# EAGLE design bt (EAGLE 7.4.0)
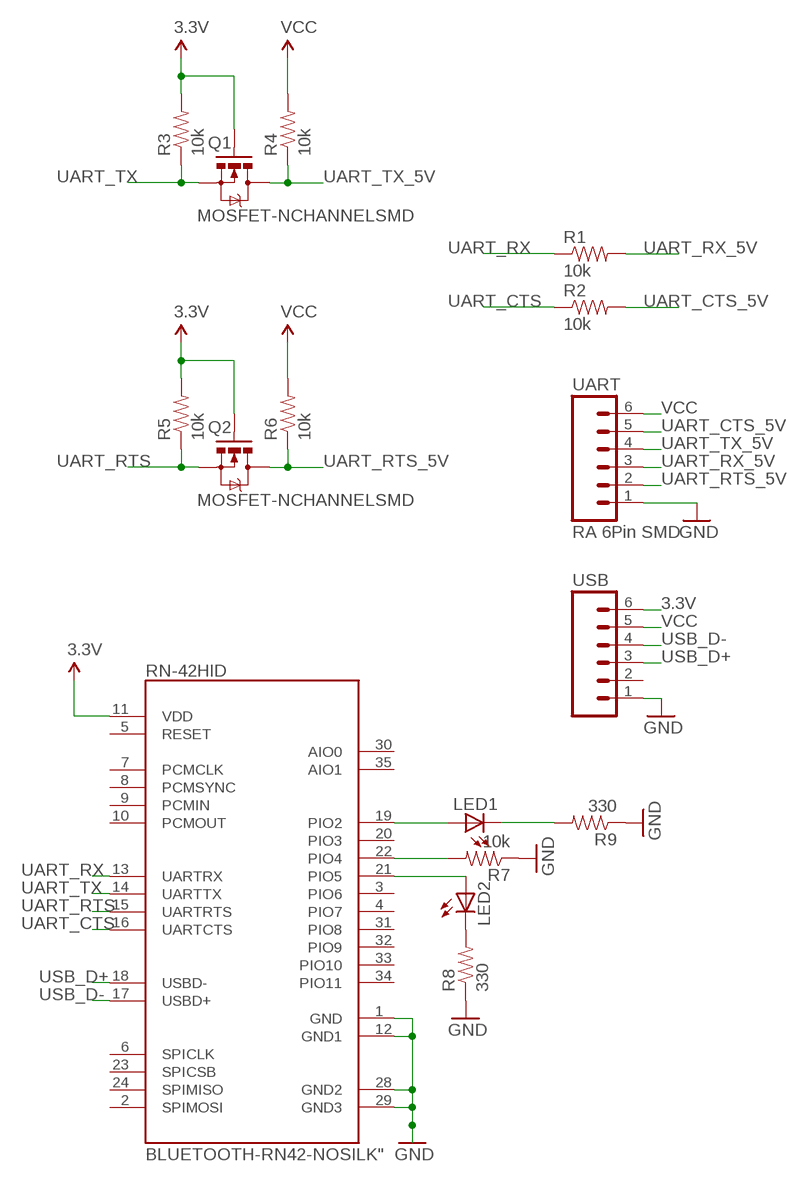
[diagram p0: schematic, sheet 1]

## Parts
LED1  LEDCHIP-LED0805  [CHIP-LED0805]
LED2  LEDCHIP-LED0805  [CHIP-LED0805]
Q1  MOSFET-NCHANNELSMD  [SOT23-3]
Q2  MOSFET-NCHANNELSMD  [SOT23-3]
R1  10k  0.22OHM-1/4W-1%(0805)  [0805]
R2  10k  0.22OHM-1/4W-1%(0805)  [0805]
R3  10k  0.22OHM-1/4W-1%(0805)  [0805]
R4  10k  0.22OHM-1/4W-1%(0805)  [0805]
R5  10k  0.22OHM-1/4W-1%(0805)  [0805]
R6  10k  0.22OHM-1/4W-1%(0805)  [0805]
R7  10k  0.22OHM-1/4W-1%(0805)  [0805]
R8  330  0.22OHM-1/4W-1%(0805)  [0805]
R9  330  0.22OHM-1/4W-1%(0805)  [0805]
RN-42HID  BLUETOOTH-RN42-NOSILK"  [RN41]
UART  RA 6Pin SMD  M06SMD-NOHOLES  [1X06-SMD-NOHOLES]
USB  M06SMD-FEMALE-V2-NOSILK  [1X06-SMD-FEMALE-V2-NOSILK]

## Nets
3.3V: Q1.1(G) Q2.1(G) R3.2 R5.2 USB.6
GND: R7.1 R8.1 R9.1 RN-42HID.1(GND) RN-42HID.12(GND1) RN-42HID.28(GND2) RN-42HID.29(GND3) UART.1 USB.1
N$1: LED2.C R8.2
N$3: LED1.C R9.2
N$8: LED1.A RN-42HID.19(PIO2)
N$9: R7.2 RN-42HID.22(PIO4)
N$10: LED2.A RN-42HID.21(PIO5)
UART_CTS: R2.1 RN-42HID.16(UARTCTS)
UART_CTS_5V: R2.2 UART.5
UART_RTS: Q2.2(S) R5.1 RN-42HID.15(UARTRTS)
UART_RTS_5V: Q2.3(D) R6.1 UART.2
UART_RX: R1.1 RN-42HID.13(UARTRX)
UART_RX_5V: R1.2 UART.3
UART_TX: Q1.2(S) R3.1 RN-42HID.14(UARTTX)
UART_TX_5V: Q1.3(D) R4.1 UART.4
USB_D+: RN-42HID.18(USBD-) USB.3
USB_D-: RN-42HID.17(USBD+) USB.4
VCC: R4.2 R6.2 RN-42HID.11(VDD) UART.6 USB.5 ; supply symbol labelled 3.3V
Unconnected: RN-42HID.2(SPIMOSI) RN-42HID.3(PIO6) RN-42HID.4(PIO7) RN-42HID.5(RESET) RN-42HID.6(SPICLK) RN-42HID.7(PCMCLK) RN-42HID.8(PCMSYNC) RN-42HID.9(PCMIN) RN-42HID.10(PCMOUT) RN-42HID.20(PIO3) RN-42HID.23(SPICSB) RN-42HID.24(SPIMISO) RN-42HID.30(AIO0) RN-42HID.31(PIO8) RN-42HID.32(PIO9) RN-42HID.33(PIO10) RN-42HID.34(PIO11) RN-42HID.35(AIO1) USB.2

## Library data of the parts
LED1 LED2 = adafruit:LED: LED OSRAM: - CHIPLED LG R971, LG N971, LY N971, LG Q971, LY Q971, LO R971, LY R971 LH N974, LH R974 LS Q976, LO Q976, LY Q976 LO Q996 - Hyper CHIPLED LW Q18S LB Q993, LB Q99A, LB R99A - SideLED LS A670, LO A670, LY A670, LG A670, LP A670 LB A673, LV A673, LT A673, LW A673 LH A674 LY A675 LS A676, LA A676, LO A676, LY A676, LW A676 LS A679, LY A679, LG A679 - Hyper Micro SIDELED® LS Y876, LA Y876, LO Y876, LY Y876 LT Y87S - SmartLED LW L88C, LW L88S LB L89C, LB L89S, LG L890 LS L89K, LO L89K, LY L89K LS L896, LA L896, LO L896, LY L896 - TOPLED LS T670, LO T670, LY T670, LG T670, LP T670 LSG T670, LSP T670, LSY T670, LOP T670, LYG T670 LG T671, LOG T671, LSG T671 LB T673, LV T673, LT T673, LW T673 LH T674 LS T676, LA T676, LO T676, LY T676, LB T676, LH T676, LSB T676, LW T676 LB T67C, LV T67C, LT T67C, LS T67K, LO T67K, LY T67K, LW E67C LS E67B, LA E67B, LO E67B, LY E67B, LB E67C, LV E67C, LT E67C LW T67C LS T679, LY T679, LG T679 LS T770, LO T770, LY T770, LG T770, LP T770 LB T773, LV T773, LT T773, LW T773 LH T774 LS E675, LA E675, LY E675, LS T675 LS T776, LA T776, LO T776, LY T776, LB T776 LHGB T686 LT T68C, LB T68C - Hyper Mini TOPLED® LB M676 - Mini TOPLED Santana® LG M470 LS M47K, LO M47K, LY M47K Source: http://www.osram.convergy.de/
Q1 Q2 = SparkFun:MOSFET-NCHANNEL
R1-R9 = SparkFun-Resistors:0.22OHM-1/4W-1%(0805): RES-09883; PROD_ID: RES-09883; VALUE: 0.22
RN-42HID = mine:BLUETOOTH-RN42-NOSILK: Bluetooth SMD module
UART = mine:M06: Header 6 Standard 6-pin 0.1" header. Use with straight break away headers (SKU : PRT-00116), right angle break away headers (PRT-00553), swiss pins (PRT-00743), machine pins (PRT-00117), and female headers (PRT-00115). Molex polarized connector foot print use with SKU : PRT-08094 with associated crimp pins and housings. NOTES ON THE VARIANTS LOCK and LOCK_LONGPADS... This footprint was designed to help hold the alignment of a through-hole component (i.e. 6-pin header) while soldering it into place. You may notice that each hole has been shifted either up or down by 0.005 of an inch from it's more standard position (which is a perfectly straight line). This slight alteration caused the pins (the squares in the middle) to touch the edges of the holes. Because they are alternating, it causes a "brace" to hold the component in place. 0.005 has proven to be the perfect amount of "off-center" position when using our standard breakaway headers. Although looks a little odd when you look at the bare footprint, once you have a header in there, the alteration is very hard to notice. Also,if you push a header all the way into place, it is covered up entirely on the bottom side. This idea of altering the position of holes to aid alignment will be further integrated into the Sparkfun Library for other footprints. It can help hold any component with 3 or more connection pins.; PROD_ID: CONN-08971
USB = mine:M06: Header 6 Standard 6-pin 0.1" header. Use with straight break away headers (SKU : PRT-00116), right angle break away headers (PRT-00553), swiss pins (PRT-00743), machine pins (PRT-00117), and female headers (PRT-00115). Molex polarized connector foot print use with SKU : PRT-08094 with associated crimp pins and housings. NOTES ON THE VARIANTS LOCK and LOCK_LONGPADS... This footprint was designed to help hold the alignment of a through-hole component (i.e. 6-pin header) while soldering it into place. You may notice that each hole has been shifted either up or down by 0.005 of an inch from it's more standard position (which is a perfectly straight line). This slight alteration caused the pins (the squares in the middle) to touch the edges of the holes. Because they are alternating, it causes a "brace" to hold the component in place. 0.005 has proven to be the perfect amount of "off-center" position when using our standard breakaway headers. Although looks a little odd when you look at the bare footprint, once you have a header in there, the alteration is very hard to notice. Also,if you push a header all the way into place, it is covered up entirely on the bottom side. This idea of altering the position of holes to aid alignment will be further integrated into the Sparkfun Library for other footprints. It can help hold any component with 3 or more connection pins.; PROD_ID: CONN-09668

## Board
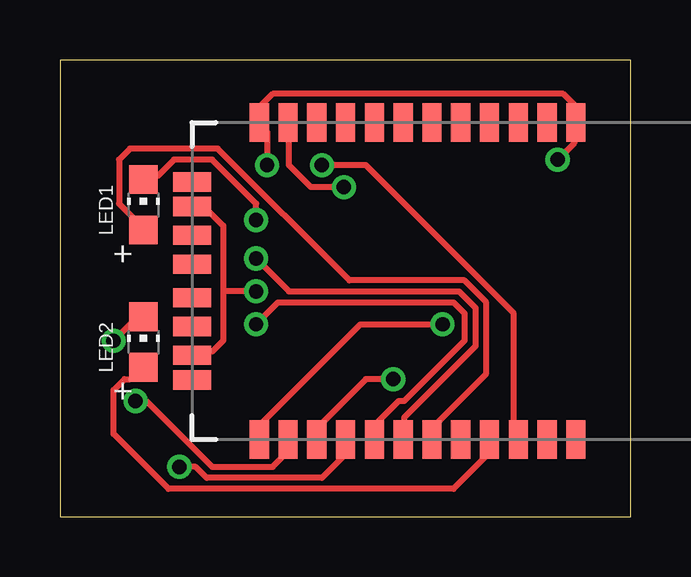
[diagram p1: board, top side]
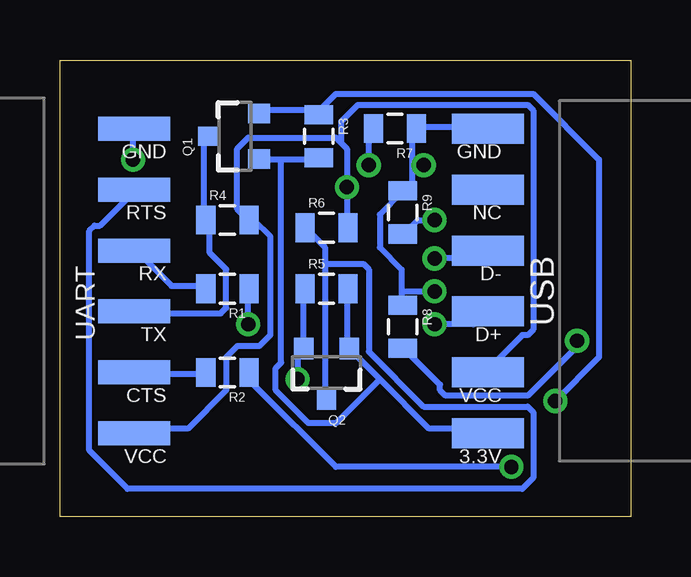
[diagram p2: board, bottom side, seen from below]

Size 23.8 x 19.04 mm. Coordinates in mm from the lower left corner, seen from the top.
Outline: 23.8,19.04 0,19.04 0,0 23.8,0 23.8,19.04
Copper layers (1*16): Top 0.035mm / dielectric 1.5mm / Bottom 0.035mm
Design rules "default": minimum track width 10mil, minimum drill 0.6mm, track to track 8mil, track to pad 8mil, pad to pad 8mil, via to via 8mil, smd to smd 8mil, copper to edge 40mil, drill to drill 8mil, minimum pad ring 10mil, minimum via ring 8mil, stop-mask expansion 4mil, vias tented up to drill 0mil, thermal gap 10mil

### Footprints (pad centres in the part's own frame; a part is rotated, then mirrored left to right if it is on the bottom)
CHIP-LED0805 = smd 1.2 x 1.2: A 0,-1.05; C 0,1.05
SOT23-3 = smd 0.8 x 0.9: 1 -0.95,-1; 2 0.95,-1; 3 0,1.1
0805 = smd 0.8 x 1.2: 1 -0.9,0; 2 0.9,0
RN41 = smd 0.8 x 1.6: 1 -6.6,-6.6; 2 -5.4,-6.6; 3 -4.2,-6.6; 4 -3,-6.6; 5 -1.8,-6.6; 6 -0.6,-6.6; 7 0.6,-6.6; 8 1.8,-6.6; 9 3,-6.6; 10 4.2,-6.6; 11 5.4,-6.6; 12 6.6,-6.6; 13 6.6,6.6; 14 5.4,6.6; 15 4.2,6.6; 16 3,6.6; 17 1.8,6.6; 18 0.6,6.6; 19 -0.6,6.6; 20 -1.8,6.6; 21 -3,6.6; 22 -4.2,6.6; 23 -5.4,6.6; 24 -6.6,6.6 | smd 1.6 x 0.8: 28 9.4,3.1; 29 9.4,-3.1; 30 9.4,4.122; 31 9.4,1.9; 32 9.4,0.7; 33 9.4,-0.7; 34 9.4,-1.9; 35 9.4,-4.122
1X06-SMD-NOHOLES = smd 1 x 3: 1 -6.35,5; 2 -3.81,5; 3 -1.27,5; 4 1.27,5; 5 3.81,5; 6 6.35,5
1X06-SMD-FEMALE-V2-NOSILK = smd 1.25 x 3: 1 6.35,3.425; 2 3.81,3.425; 3 1.27,3.425; 4 -1.27,3.425; 5 -3.81,3.425; 6 -6.35,3.425

### Placement (x,y rotation side)
LED1  3.48,13.01 0 top
LED2  3.48,7.29 0 top
Q1  16.5,15.87 90 bottom
Q2  12.69,6.02 180 bottom
R1  16.82,9.52 180 bottom
R2  16.82,6.02 180 bottom
R3  13.01,15.87 270 bottom
R4  16.82,12.37 0 bottom
R5  12.69,9.52 0 bottom
R6  12.69,12.05 0 bottom
R7  9.83,16.18 180 bottom
R8  9.51,7.93 270 bottom
R9  9.51,12.69 270 bottom
RN-42HID  14.91,9.83 180 top
UART  25.71,9.83 270 bottom
USB  2.53,9.83 90 bottom

### Tracks (layer width: path | path; a pad name or v marks a point on that pad's centre or on a via)
3.3V
  Bottom 0.254: 14.58,14.89 13.21,14.89 R3.2 | 14.58,14.89 15.49,14.89 Q1.1 | R5.2 11.84,9.4 11.84,7.12 Q2.1 11.61,6.89 10.46,5.74 | 10.46,5.74 8.41,3.69 6.12,3.69 USB.6 | 14.58,14.89 14.58,6.43 14.81,6.2 14.81,5.29 13.44,3.91 12.29,3.91 10.46,5.74
GND  (via drill 0.6)
  Top 0.254: 6.81,9.4 6.81,12.14 6.12,12.83 5.66,12.83 RN-42HID.29 | 6.81,9.4 6.81,7.34 6.35,6.89 5.66,6.89 RN-42HID.28 | v8.18,9.4 6.81,9.4 | v20.75,14.89 21.44,15.57 21.44,16.26 RN-42HID.1 21.44,16.49 21.44,17.17 20.98,17.63 8.86,17.63 8.41,17.17 8.41,16.49 RN-42HID.12 8.41,16.26 8.64,16.03 v8.64,14.66
  Bottom 0.254: 9.55,9.4 9.55,10.31 10.46,11.23 10.46,12.6 9.55,13.52 R9.1 9.32,13.74 9.09,13.97 9.09,14.66 | 9.55,9.4 9.55,8.94 R8.1 | 9.09,14.66 9.09,16.03 R7.1 8.86,16.26 6.12,16.26 USB.1 | 9.55,9.4 v8.18,9.4 | v20.75,14.89 20.75,16.03 UART.1 | v8.64,14.66 9.09,14.66
N$1  (via drill 0.6)
  Top 0.254: v2.24,7.34 3.38,8.49 LED2.C
  Bottom 0.254: v2.24,7.34 2.24,7.12 4.29,5.06 7.72,5.06 7.95,5.29 7.95,5.51 9.32,6.89 R8.2
N$3  (via drill 0.6)
  Top 0.254: v8.18,12.37 8.18,13.06 6.35,14.89 4.75,14.89 4.06,14.2 3.61,14.2 LED1.C
  Bottom 0.254: v8.18,12.37 8.86,12.37 9.32,11.92 R9.2
N$8
  Top 0.254: LED1.A 3.38,12.14 2.46,13.06 2.46,14.89 2.92,15.34 6.58,15.34 12.07,9.86 16.87,9.86 17.78,8.94 17.78,5.97 15.72,3.91 15.72,3.46 RN-42HID.19
N$9  (via drill 0.6)
  Top 0.254: v10.92,14.66 12.75,14.66 18.92,8.49 18.92,3.46 RN-42HID.22
  Bottom 0.254: v10.92,14.66 10.92,16.03 R7.2
N$10
  Top 0.254: LED2.A 3.38,6.2 2.92,5.74 2.69,5.74 2.24,5.29 2.24,3.46 4.52,1.17 16.41,1.17 17.78,2.54 17.78,3.23 RN-42HID.21
UART_CTS  (via drill 0.6)
  Top 0.254: v4.98,2.09 5.66,2.09 6.12,1.63 10.92,1.63 11.84,2.54 11.84,3.23 RN-42HID.16
  Bottom 0.254: v4.98,2.09 12.29,2.09 15.72,5.51 15.72,5.97 R2.1
UART_CTS_5V
  Bottom 0.254: R2.2 17.78,5.97 20.52,5.97 UART.5
UART_RTS  (via drill 0.6)
  Top 0.254: v13.89,5.74 12.75,5.74 10.92,3.91 10.92,3.46 RN-42HID.15
  Bottom 0.254: R5.1 13.67,9.4 13.67,7.12 Q2.2 13.67,6.89 13.89,6.66 v13.89,5.74
UART_RTS_5V
  Bottom 0.254: 12.75,10.54 12.75,11.23 13.44,11.92 R6.1 | 12.75,10.54 12.75,5.06 Q2.3 | 12.75,10.54 11.15,10.54 10.92,10.31 10.92,6.89 8.64,4.6 4.29,4.6 4.06,4.37 4.06,1.63 4.52,1.17 20.98,1.17 22.58,2.77 22.58,11.92 22.35,12.14 22.12,12.14 20.75,13.52 UART.2
UART_RX  (via drill 0.6)
  Top 0.254: v15.95,8.03 12.52,8.03 8.41,3.91 8.41,3.46 RN-42HID.13
  Bottom 0.254: v15.95,8.03 15.95,9.4 R1.1
UART_RX_5V
  Bottom 0.254: R1.2 17.78,9.63 19.15,9.63 20.52,11 UART.3
UART_TX  (via drill 0.6)
  Top 0.254: v3.15,4.83 3.61,4.83 6.35,2.09 8.86,2.09 9.32,2.54 9.32,3.23 RN-42HID.14
  Bottom 0.254: Q1.2 15.49,16.94 13.21,16.94 R3.1 12.98,16.94 12.29,17.63 4.06,17.63 1.32,14.89 1.32,6.66 v3.15,4.83
UART_TX_5V
  Bottom 0.254: Q1.3 17.78,15.8 17.78,12.37 R4.1 17.55,12.37 17.55,11 16.87,10.31 16.87,8.71 17.09,8.49 20.52,8.49 UART.4
USB_D+  (via drill 0.6)
  Top 0.254: v8.18,10.77 9.55,9.4 16.64,9.4 17.32,8.71 17.32,7.12 14.35,4.14 14.35,3.46 RN-42HID.18
  Bottom 0.254: v8.18,10.77 6.35,10.77 6.12,11 USB.3
USB_D-  (via drill 0.6)
  Top 0.254: v8.18,8.03 9.09,8.94 16.41,8.94 16.87,8.49 16.87,7.34 14.35,4.83 14.12,4.83 13.21,3.91 13.21,3.46 RN-42HID.17
  Bottom 0.254: v8.18,8.03 6.58,8.03 6.12,8.49 USB.4
VCC  (via drill 0.6)
  Top 0.254: v11.84,13.74 10.46,13.74 9.55,14.66 9.55,16.26 RN-42HID.11
  Bottom 0.254: 12.07,15.57 12.29,15.8 15.95,15.8 16.41,15.34 16.41,12.83 15.95,12.37 R4.2 15.72,12.37 15.04,11.69 15.04,7.57 15.49,7.12 16.41,7.12 16.87,6.66 16.87,5.29 18.47,3.69 20.52,3.69 UART.6 | 12.07,15.57 11.84,15.34 v11.84,13.74 11.84,12.14 R6.2 | 12.07,15.57 12.07,16.49 11.38,17.17 4.29,17.17 4.06,16.94 4.06,7.8 4.29,7.57 4.52,7.57 5.89,6.2 USB.5

### Text on the board
bPlace: GND | GND | NC | RTS | D- | RX | D+ | TX | VCC | CTS | 3.3V | VCC